# Altium schematic sheet Sensors.SchDoc
size A4; SheetNumber: 10; SheetTotal: 13
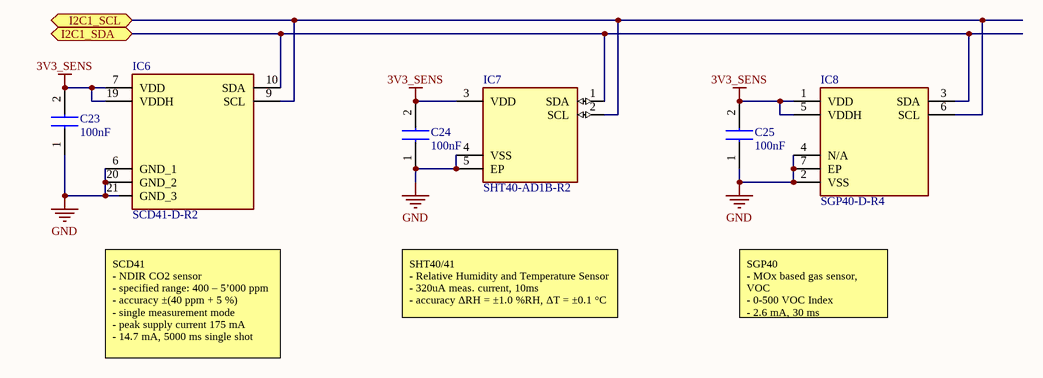
[diagram p0: Sensors.SchDoc]

## Parts
C23  100nF  [CAPC1005X70N]
C24  100nF  [CAPC1005X70N]
C25  100nF  [CAPC1005X70N]
IC6  SCD41-D-R2  [SCD41DR2]
IC7  SHT40-AD1B-R2  [SON80P150X150X59-5N]
IC8  SGP40-D-R4  [SON80P244X244X95-7N]

## Ports
I2C1_SCL (bidir, see main[3B], NFC[2C]), I2C1_SDA (bidir, see main[3B], NFC[2C])

## Nets
3V3_SENS: C23.2 C24.2 C25.2 IC6.7(VDD) IC6.19(VDDH) IC7.3(VDD) IC8.1(VDD) IC8.5(VDDH)
GND: C23.1 C24.1 C25.1 IC6.6(GND_1) IC6.20(GND_2) IC6.21(GND_3) IC7.4(VSS) IC7.5(EP) IC8.2(VSS) IC8.4(N/A) IC8.7(EP)
I2C1_SCL: IC6.9(SCL) IC7.2(SCL) IC8.6(SCL) ; port I2C1_SCL
I2C1_SDA: IC6.10(SDA) IC7.1(SDA) IC8.3(SDA) ; port I2C1_SDA

## Notes on the sheet
- SHT40/41
  - Relative Humidity and Temperature Sensor
  - 320uA meas. current, 10ms
  - accuracy ΔRH = ±1.0 %RH, ΔT = ±0.1 °C
- SGP40
  - MOx based gas sensor, VOC
  - 0-500 VOC Index
  - 2.6 mA, 30 ms
- SCD41
  - NDIR CO2 sensor
  - specified range: 400 – 5’000 ppm
  - accuracy ±(40 ppm + 5 %)
  - single measurement mode
  - peak supply current 175 mA
  - 14.7 mA, 5000 ms single shot
- Title:
- Date:
- Project:
- Type:
- Schematic
- Variant:
- Revision:
- Sheet
- of
- Author:
- Evžen Šteif
- Size:
- A4

## Library data of the parts
C23-C25 = GRM155R61A104KA01D: Capacitor; Manufacturer_Name: Murata Electronics; Datasheet Link: https://search.murata.co.jp/Ceramy/image/img/A01X/G101/ENG/GRM155R61A104KA01-02A.pdf; Height: 0.7mm; Manufacturer_Part_Number: GRM155R61A104KA01D; Mouser Part Number: 81-GRM155R61A104KA01; Mouser Price/Stock: https://www.mouser.co.uk/ProductDetail/Murata-Electronics/GRM155R61A104KA01D?qs=5bAuhL3RhmNZw0v59AqOJA%3D%3D; Arrow Part Number: GRM155R61A104KA01D; Arrow Price/Stock: https://www.arrow.com/en/products/grm155r61a104ka01d/murata-manufacturing?utm_currency=USD&region=europe
IC6 = SCD41-D-R2: Integrated Circuit; Manufacturer_Name: Sensirion; Datasheet Link: https://cz.mouser.com/datasheet/2/682/Sensirion_CO2_Sensors_SCD4x_Datasheet-2010009.pdf; Height: 6.8mm; Manufacturer_Part_Number: SCD41-D-R2; Mouser Part Number: 403-SCD41-D-R2; Mouser Price/Stock: https://www.mouser.co.uk/ProductDetail/Sensirion/SCD41-D-R2?qs=HBWAp0VN4Ri4o7ei4T3s0g%3D%3D; Arrow Part Number: SCD41-D-R2; Arrow Price/Stock: https://www.arrow.com/en/products/scd41-d-r2/sensirion-ag?region=nac
IC7 = SHT40-AD1B-R2: Integrated Circuit; Manufacturer_Name: Sensirion; Datasheet Link: https://www.mouser.dk/datasheet/2/682/Sensirion_10272020_Datasheet_SHT4x-1919523.pdf; Height: 0.59mm; Manufacturer_Part_Number: SHT40-AD1B-R2; Mouser Part Number: 403-SHT40-AD1B-R2; Mouser Price/Stock: https://www.mouser.co.uk/ProductDetail/Sensirion/SHT40-AD1B-R2?qs=zW32dvEIR3scTT6A4VuzaQ%3D%3D; Arrow Part Number: SHT40-AD1B-R2; Arrow Price/Stock: https://www.arrow.com/en/products/sht40-ad1b-r2/sensirion-ag?utm_currency=USD&region=nac
IC8 = SGP40-D-R4: Integrated Circuit; Manufacturer_Name: Sensirion; Datasheet Link: https://www.mouser.com/datasheet/2/682/Sensirion_Gas_Sensors_SGP40_Datasheet-1888696.pdf; Height: 0.95mm; Manufacturer_Part_Number: SGP40-D-R4; Mouser Part Number: 403-SGP40-D-R4; Mouser Price/Stock: https://www.mouser.co.uk/ProductDetail/Sensirion/SGP40-D-R4?qs=yqaQSyyJnNgaRqiZfsbS1Q%3D%3D; Arrow Part Number: SGP40-D-R4; Arrow Price/Stock: https://www.arrow.com/en/products/sgp40-d-r4/sensirion-ag?utm_currency=USD&region=nac